# Altium schematic sheet main.SchDoc
size A4
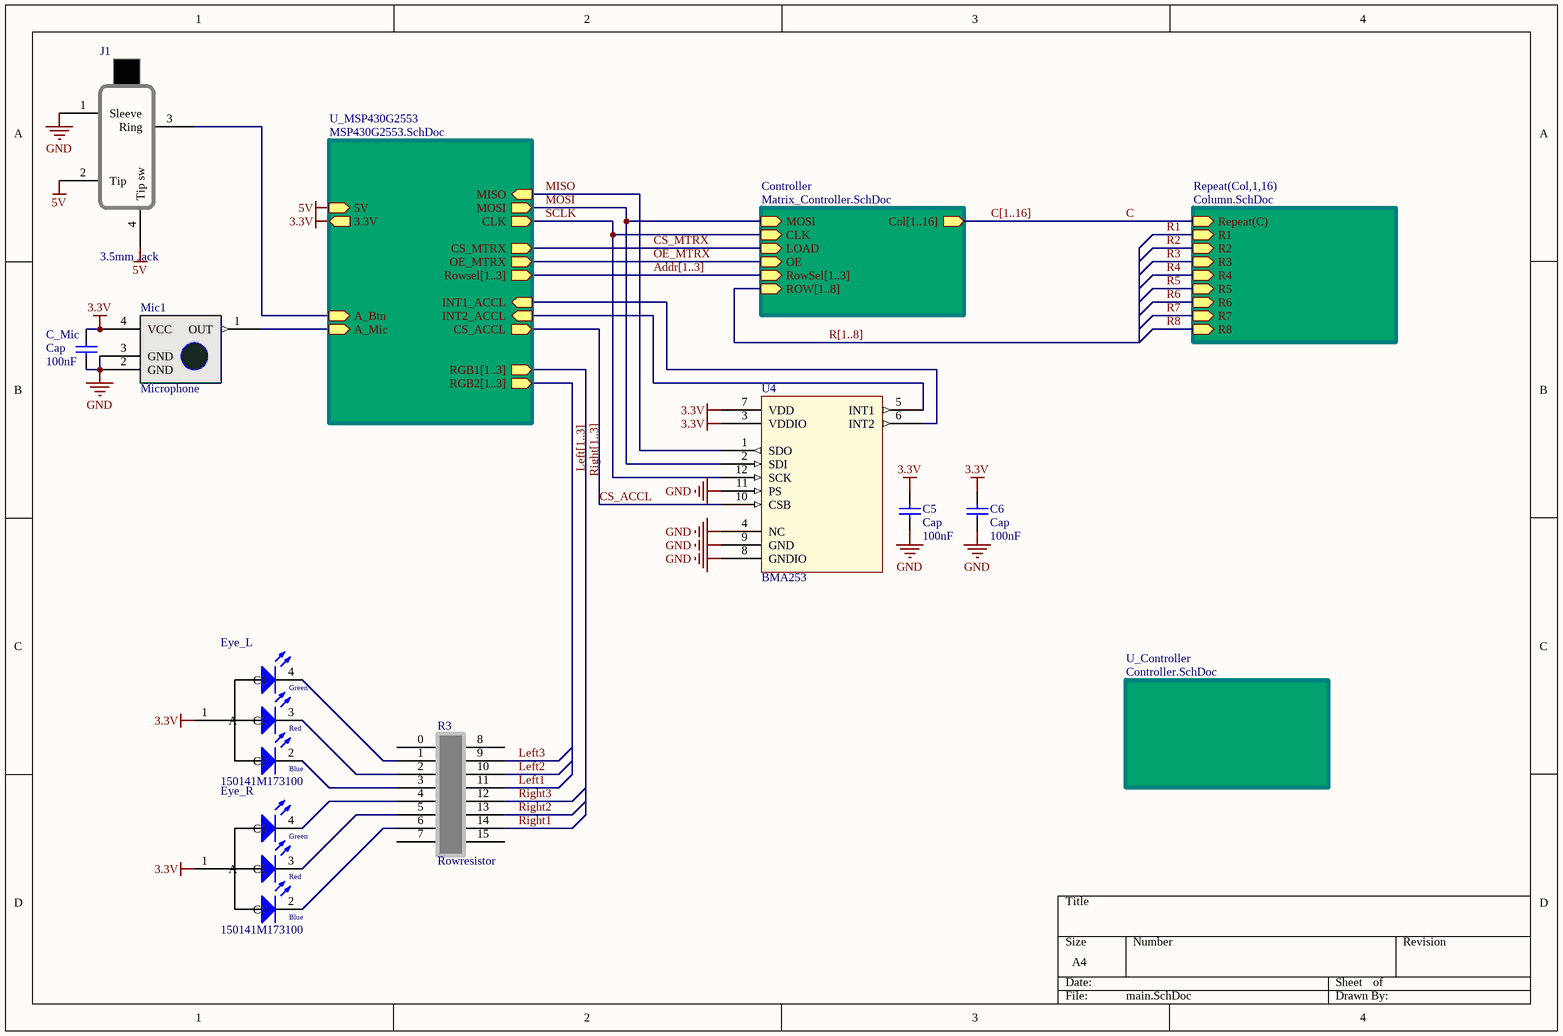
[diagram p0: main.SchDoc]

## Parts
C5  Cap  value 100nF  [6-0805_M]
C6  Cap  value 100nF  [6-0805_M]
C_Mic  Cap  value 100nF  [6-0805_M]
Eye_L  150141M173100  [3528_A]
Eye_R  150141M173100  [3528_A]
J1  3.5mm Jack  [Phonejack]
Mic1  Microphone  [SPW2430HR5H-B]
R3  Rowresistor  [Rowres]
U4  BMA253  [BMA253]

## Sub-sheets
Controller = Matrix_Controller.SchDoc: OE (in), LOAD (in), CLK (in), MOSI (in), RowSel[1..3] (in), ROW[1..8] (in), Col[1..16] (out)
Repeat(Col,1,16) = Column.SchDoc: Repeat(C) (in), R1 (in), R2 (in), R3 (in), R4 (in), R5 (in), R6 (in), R7 (in), R8 (in)
U_Controller = Controller.SchDoc: no entries
U_MSP430G2553 = MSP430G2553.SchDoc: 5V (in), 3.3V (out), MOSI (out), MISO (in), CLK (out), CS_MTRX (out), RGB1[1..3] (out), RGB2[1..3] (out), CS_ACCL (out), A_Btn (in), A_Mic (in), Rowsel[1..3] (out), OE_MTRX (out), INT1_ACCL (in), INT2_ACCL (in)

## Nets
3.3V: C5.2 C6.2 C_Mic.1 Eye_L.1(A) Eye_R.1(A) Mic1.4(VCC) U4.3(VDDIO) U4.7(VDD) ; sheet U_MSP430G2553/3.3V
5V: J1.2(Tip) J1.4(Tip_sw) ; sheet U_MSP430G2553/5V
GND: C5.1 C6.1 C_Mic.2 J1.1(Sleeve) Mic1.2(GND) Mic1.3(GND) U4.4(NC) U4.8(GNDIO) U4.9(GND) U4.11(PS)
C: sheet Repeat(Col,1,16)/Repeat(C)
CS_ACCL: U4.10(CSB) ; sheet U_MSP430G2553/CS_ACCL
CS_MTRX: sheet Controller/LOAD, sheet U_MSP430G2553/CS_MTRX
Left1: R3.11
Left2: R3.10
Left3: R3.9
MISO: U4.1(SDO) ; sheet U_MSP430G2553/MISO
MOSI: U4.2(SDI) ; sheet Controller/MOSI, sheet U_MSP430G2553/MOSI
OE_MTRX: sheet Controller/OE, sheet U_MSP430G2553/OE_MTRX
R1: sheet Repeat(Col,1,16)/R1
R2: sheet Repeat(Col,1,16)/R2
R3: sheet Repeat(Col,1,16)/R3
R4: sheet Repeat(Col,1,16)/R4
R5: sheet Repeat(Col,1,16)/R5
R6: sheet Repeat(Col,1,16)/R6
R7: sheet Repeat(Col,1,16)/R7
R8: sheet Repeat(Col,1,16)/R8
Right1: R3.14
Right2: R3.13
Right3: R3.12
SCLK: U4.12(SCK) ; sheet Controller/CLK, sheet U_MSP430G2553/CLK
NetEye_L_2: Eye_L.2(C3) R3.3
NetEye_L_3: Eye_L.3(C2) R3.2
NetEye_L_4: Eye_L.4(C1) R3.1
NetEye_R_2: Eye_R.2(C3) R3.6
NetEye_R_3: Eye_R.3(C2) R3.5
NetEye_R_4: Eye_R.4(C1) R3.4
NetJ1_3: J1.3(Ring) ; sheet U_MSP430G2553/A_Btn
NetMic1_1: Mic1.1(OUT) ; sheet U_MSP430G2553/A_Mic
NetU4_5: U4.5(INT1) ; sheet U_MSP430G2553/INT2_ACCL
NetU4_6: U4.6(INT2) ; sheet U_MSP430G2553/INT1_ACCL

Not connected (* = marked no-connect by the designer): R3 0 7 8 15

## Buses and harness runs
bus Addr[1..3] = sheet Controller/RowSel[1..3] = sheet U_MSP430G2553/Rowsel[1..3]
bus C[1..16] = sheet Controller/Col[1..16]
bus Left[1..3] = sheet U_MSP430G2553/RGB2[1..3]
bus R[1..8] = sheet Controller/ROW[1..8]
bus Right[1..3] = sheet U_MSP430G2553/RGB1[1..3]

## Notes on the sheet
- (in symbol 150141M173100) Green; Red; Blue

## Library data of the parts
C5 C6 C_Mic = Cap: Capacitor; Published: 8-Jun-2000; LatestRevisionDate: 17-Jul-2002; LatestRevisionNote: Re-released for DXP Platform.; PackageReference: RAD-0.3; Publisher: Altium Limited; PackageDescription: Radial Cap, Thru-Hole; 2 Leads; 0.3 in Pin Spacing
Eye_L Eye_R = 150141M173100: SMD Full-Color Top LED, WL-SFTW, Red & Green & Blue; PackageReference: 3528_A; Color: Red & Green & Blue; PartNumber: 150141M173100; ComponentLink1Description: Manufacturer URL; ComponentLink1URL: http://www.we-online.com; ComponentLink2Description: Datasheet; ComponentLink2URL: http://katalog.we-online.com/led/datasheet/150141M173100.pdf
J1 = Phonejack
Mic1 = MIC: SPW2430HR5H-B  MEMs Microphone
R3 = Rowres: Row resistor, 8
U4 = ACCELEROMETER